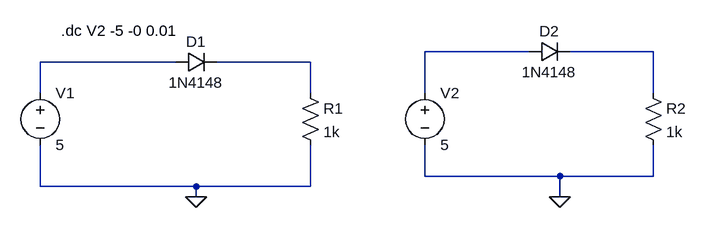
[diagram p0: schematic Ex-1.asc]
Ex-1.asc, the LTspice schematic file:
Version 4
SHEET 1 880 680
WIRE 416 64 256 64
WIRE 608 64 480 64
WIRE -128 80 -336 80
WIRE 80 80 -64 80
WIRE -336 128 -336 80
WIRE 80 128 80 80
WIRE 256 128 256 64
WIRE 608 128 608 64
WIRE 256 256 256 208
WIRE 464 256 256 256
WIRE 608 256 608 208
WIRE 608 256 464 256
WIRE -336 272 -336 208
WIRE -96 272 -336 272
WIRE 80 272 80 208
WIRE 80 272 -96 272
WIRE -96 288 -96 272
WIRE 464 288 464 256
FLAG -96 288 0
FLAG 464 288 0
SYMBOL diode -128 96 R270
WINDOW 0 32 32 VTop 2
WINDOW 3 0 32 VBottom 2
SYMATTR InstName D1
SYMATTR Value 1N4148
SYMBOL diode 416 80 R270
WINDOW 0 32 32 VTop 2
WINDOW 3 0 32 VBottom 2
SYMATTR InstName D2
SYMATTR Value 1N4148
SYMBOL res 64 112 R0
SYMATTR InstName R1
SYMATTR Value 1k
SYMBOL res 592 112 R0
SYMATTR InstName R2
SYMATTR Value 1k
SYMBOL voltage -336 112 R0
WINDOW 123 0 0 Left 0
WINDOW 39 0 0 Left 0
SYMATTR InstName V1
SYMATTR Value 5
SYMBOL voltage 256 112 R0
WINDOW 123 0 0 Left 0
WINDOW 39 0 0 Left 0
SYMATTR InstName V2
SYMATTR Value 5
TEXT -304 32 Left 2 !.dc V2 -5 -0 0.01

The netlist it stands for:
* Ex-1.asc
D1 N003 N004 1N4148
D2 N001 N002 1N4148
R1 N004 0 1k
R2 N002 0 1k
V1 N003 0 5
V2 N001 0 5
.model D D
.lib standard.dio
.dc V2 -5 -0 0.01
.backanno
.end